# EAGLE design LeguinoUno (EAGLE 9.5.2)
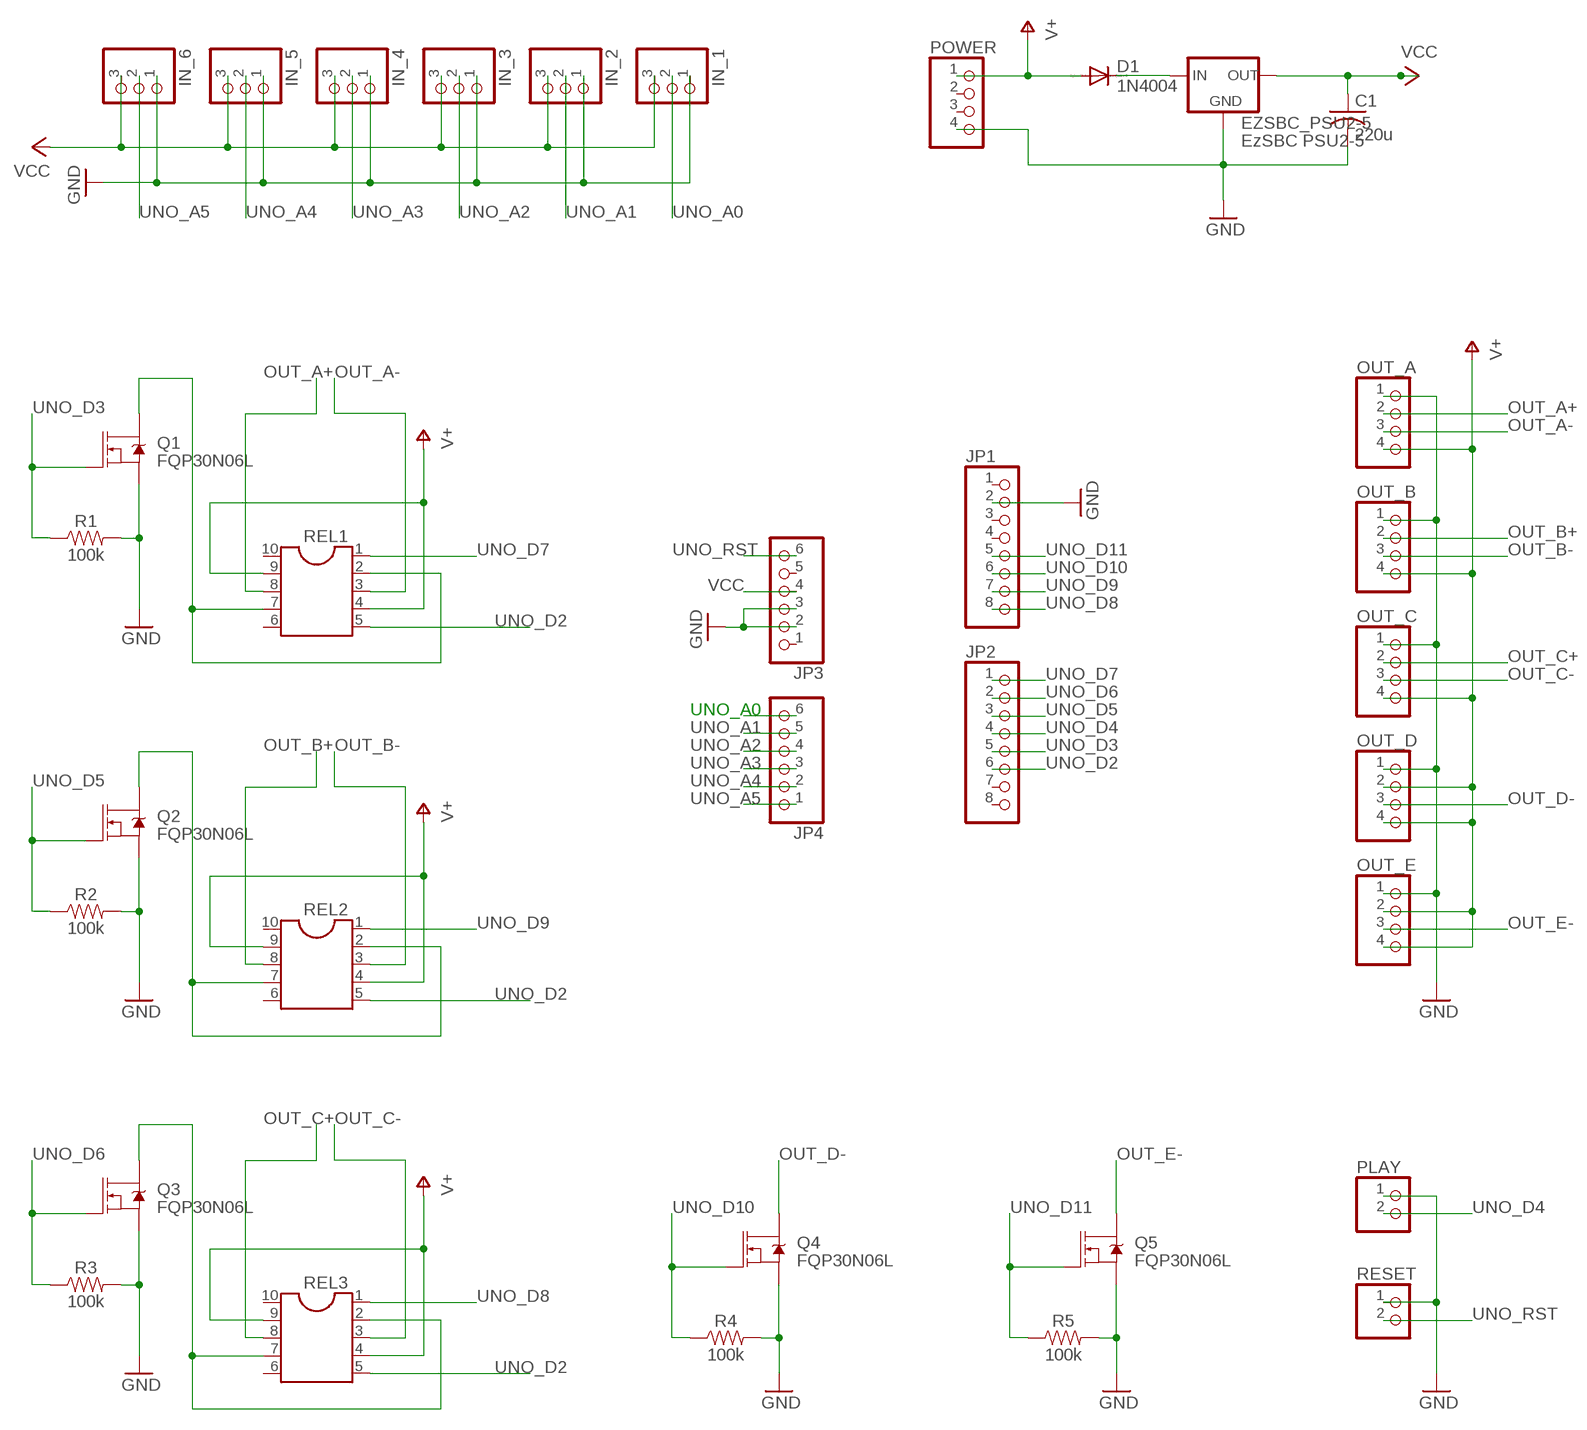
[diagram p0: schematic, sheet 1]

## Parts
C1  220u  C-US050-030X075  [C050-030X075]
D1  1N4004  [DO41-10]
EZSBC_PSU2-5  EzSBC PSU2-5  V_REG_78XX-TO-220  [TO-220-ALT]
IN_1  PINHD-1X3  [1X03]
IN_2  PINHD-1X3  [1X03]
IN_3  PINHD-1X3  [1X03]
IN_4  PINHD-1X3  [1X03]
IN_5  PINHD-1X3  [1X03]
IN_6  PINHD-1X3  [1X03]
JP1  PINHD-1X8  [1X08]
JP2  PINHD-1X8  [1X08]
JP3  PINHD-1X6  [1X06]
JP4  PINHD-1X6  [1X06]
OUT_A  PINHD-1X4  [1X04]
OUT_B  PINHD-1X4  [1X04]
OUT_C  PINHD-1X4  [1X04]
OUT_D  PINHD-1X4  [1X04]
OUT_E  PINHD-1X4  [1X04]
PLAY  PINHD-1X2  [1X02]
POWER  PINHD-1X4  [1X04]
Q1  FQP30N06L  MOSFET-NCH-FQP30N06L  [TO220V]
Q2  FQP30N06L  MOSFET-NCH-FQP30N06L  [TO220V]
Q3  FQP30N06L  MOSFET-NCH-FQP30N06L  [TO220V]
Q4  FQP30N06L  MOSFET-NCH-FQP30N06L  [TO220V]
Q5  FQP30N06L  MOSFET-NCH-FQP30N06L  [TO220V]
R1  100k  100KOHM-HORIZ-1/4W-1%  [AXIAL-0.3]
R2  100k  100KOHM-HORIZ-1/4W-1%  [AXIAL-0.3]
R3  100k  100KOHM-HORIZ-1/4W-1%  [AXIAL-0.3]
R4  100k  100KOHM-HORIZ-1/4W-1%  [AXIAL-0.3]
R5  100k  100KOHM-HORIZ-1/4W-1%  [AXIAL-0.3]
REL1  DIL10  [DIL10]
REL2  DIL10  [DIL10]
REL3  DIL10  [DIL10]
RESET  PINHD-1X2  [1X02]

## Nets
GND [supply]: C1.2 EZSBC_PSU2-5.GND IN_1.1 IN_2.1 IN_3.1 IN_4.1 IN_5.1 IN_6.1 JP1.2 JP3.2 JP3.3 OUT_A.1 OUT_B.1 OUT_C.1 OUT_D.1 OUT_E.1 PLAY.1 POWER.4 Q1.3(S) Q2.3(S) Q3.3(S) Q4.3(S) Q5.3(S) R1.P$2 R2.P$2 R3.P$2 R4.P$2 R5.P$2 RESET.1
N$1 [supply]: D1.C EZSBC_PSU2-5.IN
N$4 [supply]: Q1.2(D) REL1.2 REL1.7
N$13 [supply]: Q2.2(D) REL2.2 REL2.7
N$19 [supply]: Q3.2(D) REL3.2 REL3.7
OUT_A+ [supply]: OUT_A.2 REL1.8
OUT_A- [supply]: OUT_A.3 REL1.3
OUT_B+ [supply]: OUT_B.2 REL2.8
OUT_B- [supply]: OUT_B.3 REL2.3
OUT_C+ [supply]: OUT_C.2 REL3.8
OUT_C- [supply]: OUT_C.3 REL3.3
OUT_D- [supply]: OUT_D.3 Q4.2(D)
OUT_E- [supply]: OUT_E.3 Q5.2(D)
UNO_A0: IN_1.2 JP4.6
UNO_A1: IN_2.2 JP4.5
UNO_A2: IN_3.2 JP4.4
UNO_A3: IN_4.2 JP4.3
UNO_A4: IN_5.2 JP4.2
UNO_A5: IN_6.2 JP4.1
UNO_D2: JP2.6 REL1.5 REL2.5 REL3.5
UNO_D3: JP2.5 Q1.1(G) R1.P$1
UNO_D4: JP2.4 PLAY.2
UNO_D5: JP2.3 Q2.1(G) R2.P$1
UNO_D6: JP2.2 Q3.1(G) R3.P$1
UNO_D7: JP2.1 REL1.1
UNO_D8: JP1.8 REL3.1
UNO_D9: JP1.7 REL2.1
UNO_D10: JP1.6 Q4.1(G) R4.P$1
UNO_D11: JP1.5 Q5.1(G) R5.P$1
UNO_RST: JP3.6 RESET.2
V+ [supply]: D1.A OUT_A.4 OUT_B.4 OUT_C.4 OUT_D.2 OUT_D.4 OUT_E.2 OUT_E.4 POWER.1 REL1.4 REL1.9 REL2.4 REL2.9 REL3.4 REL3.9
VCC [supply]: C1.1 EZSBC_PSU2-5.OUT IN_1.3 IN_2.3 IN_3.3 IN_4.3 IN_5.3 IN_6.3 JP3.4
Unconnected: JP1.1 JP1.3 JP1.4 JP2.7 JP2.8 JP3.1 JP3.5 POWER.2 POWER.3 REL1.6 REL1.10 REL2.6 REL2.10 REL3.6 REL3.10

## Library data of the parts
C1 = adafruit:C-US: CAPACITOR, American symbol
D1 = diode:1N4004: DIODE general purpose rectifier, 1 A
EZSBC_PSU2-5 = SparkFun-IC-Power:V_REG_78XX: Voltage Regulator Standard 78xx regulator. IGO (Input Ground Output). Spark Fun Electronics SKU : COM-00107; PROD_ID: VREG-08450; SF_ID: COM-00107
IN_1-IN_6 = pinhead:PINHD-1X3: PIN HEADER
JP1 JP2 = pinhead:PINHD-1X8: PIN HEADER
JP3 JP4 = pinhead:PINHD-1X6: PIN HEADER
OUT_A OUT_B OUT_C OUT_D OUT_E POWER = pinhead:PINHD-1X4: PIN HEADER
PLAY RESET = pinhead:PINHD-1X2: PIN HEADER
Q1-Q5 = SparkFun-DiscreteSemi:MOSFET-NCH: N-channel MOSFETs Voltage controlled devices that allow control of high current outputs. SparkFun Products: SparkFun OpenScale <https://www.sparkfun.com/products/13261> SparkFun Digital Sandbox <https://www.sparkfun.com/products/12651> SparkFun Monster Moto Shield <https://www.sparkfun.com/products/10182> SparkFun MOSFET Power Controller <https://www.sparkfun.com/products/11214>; PROD_ID: TRANS-10060; VALUE: 60V/32A/35m?
R1-R5 = SparkFun-Resistors:100KOHM: 100k? resistor A resistor is a passive two-terminal electrical component that implements electrical resistance as a circuit element. Resistors act to reduce current flow, and, at the same time, act to lower voltage levels within circuits. - Wikipedia; PROD_ID: RES-12184
REL1-REL3 = ic-package:DIL10: Dual In Line / Socket

## Net classes
0 default: width 0.254 mm, drill 0.254 mm, clearance 0.254 mm
1 supply: width 1.016 mm, drill 1.016 mm, clearance 0.254 mm

## Board
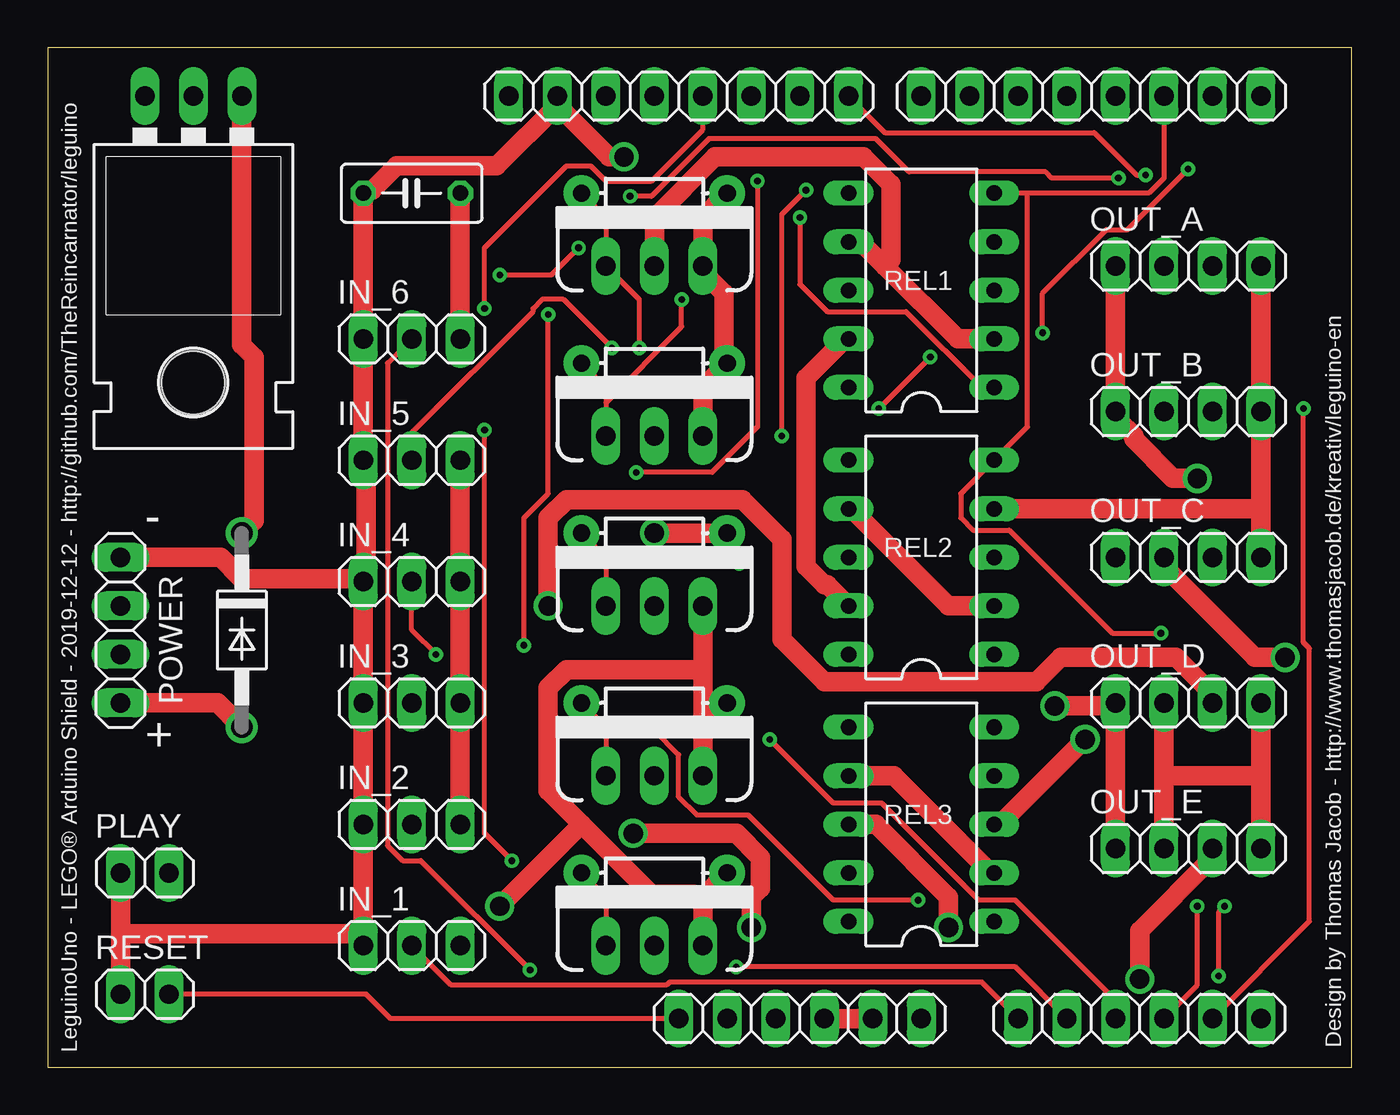
[diagram p1: board, top side]
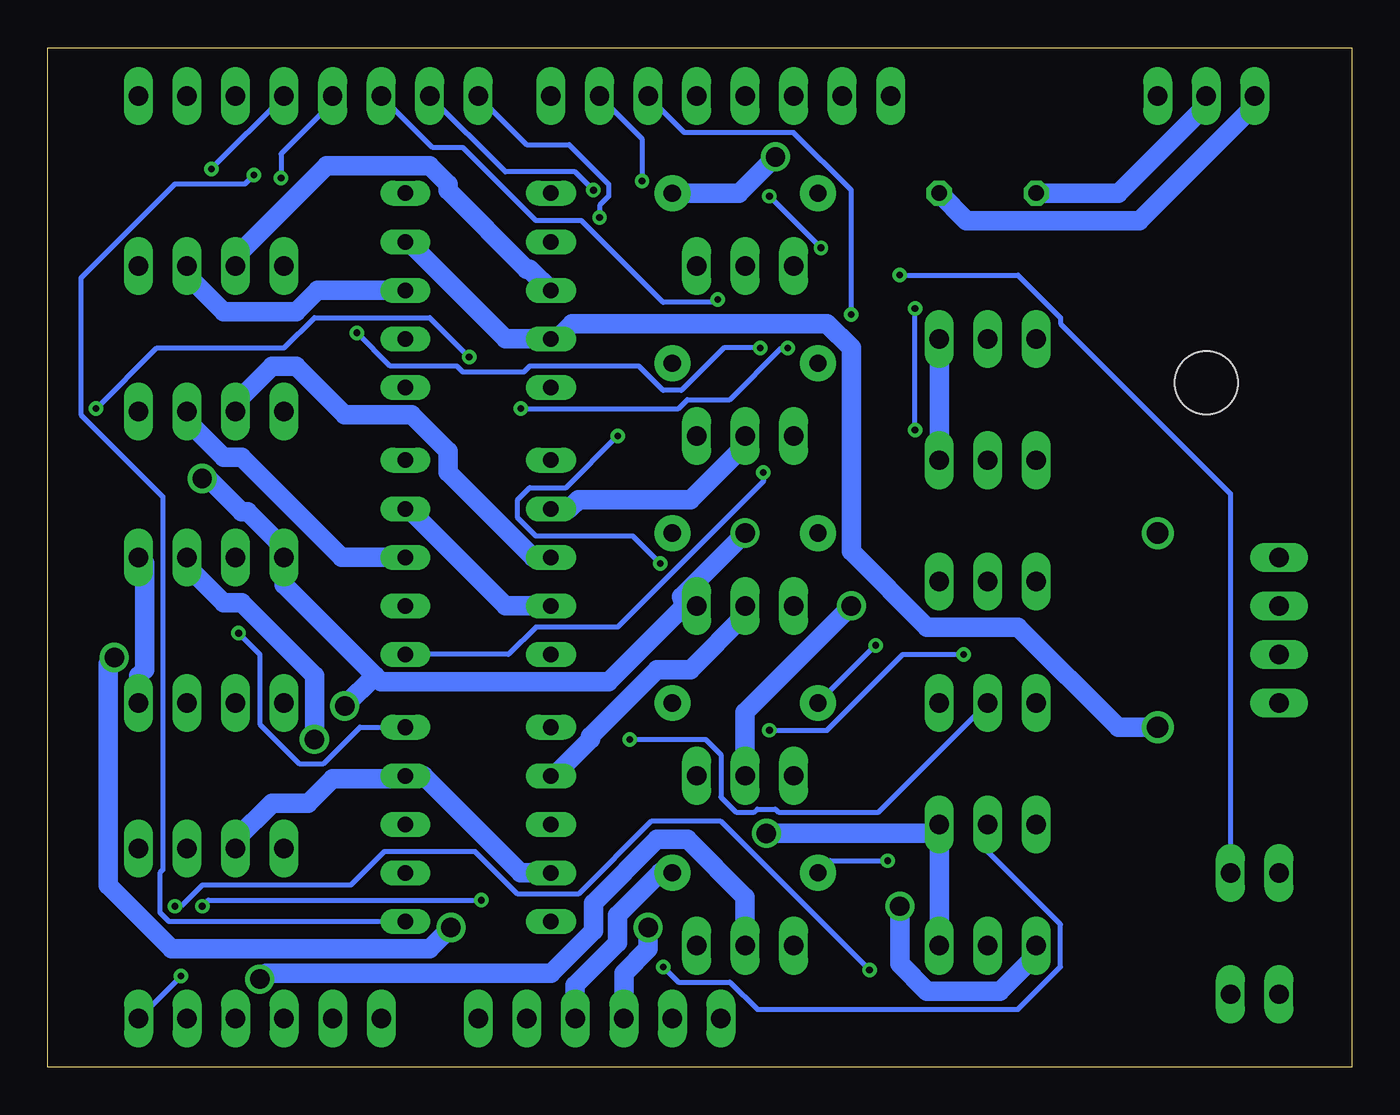
[diagram p2: board, bottom side, seen from below]

Size 68.25 x 53.33 mm. Coordinates in mm from the lower left corner, seen from the top.
Outline: 0,0 68.25,0 68.25,53.33 0,53.33 0,0
Copper layers (1*16): Top 0.035mm / dielectric 1.5mm / Bottom 0.035mm
Design rules "default *": minimum track width 10mil, minimum drill 0.35mm, track to track 10mil, track to pad 10mil, pad to pad 10mil, via to via 10mil, smd to smd 6mil, copper to edge 40mil, drill to drill 40mil, minimum pad ring 10mil, minimum via ring 8mil, stop-mask expansion 4mil, vias tented up to drill 0mil, thermal gap 10mil

### Footprints (pad centres in the part's own frame; a part is rotated, then mirrored left to right if it is on the bottom)
C050-030X075 = drill 0.813 octagon: 1 -2.54,0; 2 2.54,0
DO41-10 = drill 1.118: A 5.08,0; C -5.08,0
TO-220-ALT = drill 1.016 long: GND 0,-3.81; IN -2.54,-3.81; OUT 2.54,-3.81 | hole 3.302: 0,11.176
1X03 = drill 1.016 long: 1 -2.54,0; 2 0,0; 3 2.54,0
1X08 = drill 1.016 long: 1 -8.89,0; 2 -6.35,0; 3 -3.81,0; 4 -1.27,0; 5 1.27,0; 6 3.81,0; 7 6.35,0; 8 8.89,0
1X06 = drill 1.016 long: 1 -6.35,0; 2 -3.81,0; 3 -1.27,0; 4 1.27,0; 5 3.81,0; 6 6.35,0
1X04 = drill 1.016 long: 1 -3.81,0; 2 -1.27,0; 3 1.27,0; 4 3.81,0
1X02 = drill 1.016 long: 1 -1.27,0; 2 1.27,0
TO220V = drill 1.016 long: 1 -2.54,0; 2 0,0; 3 2.54,0
AXIAL-0.3 = drill 0.9 pad 1.88: P$1 -3.81,0; P$2 3.81,0
DIL10 = drill 0.813 long: 1 -5.08,-3.81; 2 -2.54,-3.81; 3 0,-3.81; 4 2.54,-3.81; 5 5.08,-3.81; 6 5.08,3.81; 7 2.54,3.81; 8 0,3.81; 9 -2.54,3.81; 10 -5.08,3.81

### Placement (x,y rotation side)
C1  19.05,45.72 180 top
D1  10.16,22.86 270 top
EZSBC_PSU2-5  7.62,46.99 180 top
IN_1  19.05,6.35 0 top
IN_2  19.05,12.7 0 top
IN_3  19.05,19.05 0 top
IN_4  19.05,25.4 0 top
IN_5  19.05,31.75 0 top
IN_6  19.05,38.1 0 top
JP1  33.02,50.8 0 top
JP2  54.61,50.8 0 top
JP3  39.37,2.54 180 top
JP4  57.15,2.54 180 top
OUT_A  59.69,41.91 0 top
OUT_B  59.69,34.29 0 top
OUT_C  59.69,26.67 0 top
OUT_D  59.69,19.05 0 top
OUT_E  59.69,11.43 0 top
PLAY  5.08,10.16 0 top
POWER  3.81,22.86 90 top
Q1  31.75,41.91 0 top
Q2  31.75,33.02 0 top
Q3  31.75,24.13 0 top
Q4  31.75,15.24 0 top
Q5  31.75,6.35 0 top
R1  31.75,45.72 0 top
R2  31.75,36.83 0 top
R3  31.75,27.94 0 top
R4  31.75,19.05 0 top
R5  31.75,10.16 0 top
REL1  45.72,40.64 90 top
REL2  45.72,26.67 90 top
REL3  45.72,12.7 90 top
RESET  5.08,3.81 0 top

### Tracks (layer width: path | path; a pad name or v marks a point on that pad's centre or on a via)
GND  (via drill 1.02)
  Top 1.016: JP3.2 JP3.3 | 34.29,8.89 Q5.3 | R5.P$2 34.29,8.89 | OUT_A.1 OUT_B.1 56.04,33.81 56.83,33.02 56.83,32.86 58.9,30.8 v60.17,30.8 | OUT_E.1 OUT_D.1 55.4,18.89 v52.7,18.89 | Q4.3 34.29,17.78 34.61,18.1 | R4.P$2 34.61,18.1 | 34.29,20.8 34.29,18.41 34.61,18.1 | 34.29,20.8 Q3.3 | v31.75,27.94 R3.P$2 | 27.94,12.7 26.19,14.45 26.19,19.84 27.15,20.8 34.29,20.8 | 27.94,12.7 31.59,9.05 33.81,9.05 34.29,8.89 | PLAY.1 3.81,6.99 | 3.81,6.99 RESET.1 | 16.51,6.99 IN_2.1 IN_3.1 IN_4.1 | 16.51,6.99 IN_1.1 | POWER.4 9.05,26.67 10.16,25.56 16.03,25.56 IN_4.1 | 16.51,6.99 3.81,6.99 | Q2.3 34.29,35.56 R2.P$2 35.4,37.31 35.4,40.48 34.45,41.43 Q1.3 34.29,44.45 R1.P$2 | v30.16,47.62 29.37,47.62 26.99,50.01 JP1.2 26.67,50.32 23.5,47.15 18.26,47.15 16.99,45.88 C1.2 IN_6.1 IN_5.1 16.67,31.27 16.67,25.88 IN_4.1 | v23.65,8.41 27.94,12.7
  Bottom 1.016: JP3.3 40.64,4.29 38.42,6.51 38.42,7.94 36.19,10.16 R5.P$2 | 51.12,20.48 50.8,20.16 38.89,20.16 34.92,24.13 | 51.12,20.48 55.88,25.24 OUT_C.1 55.88,27.15 57.78,29.05 58.1,29.05 59.85,30.8 v60.17,30.8 | Q3.3 34.92,24.13 | v31.75,27.94 35.08,24.61 34.92,24.13 | 51.12,20.48 v52.7,18.89 | EZSBC_PSU2-5.GND 7.62,50.32 12.22,45.72 C1.2 | R1.P$2 32.07,45.72 v30.16,47.62 | v23.65,8.41 23.65,5.4 22.23,3.97 18.41,3.97 16.51,5.87 IN_1.1
N$1
  Top 1.016: EZSBC_PSU2-5.IN 10.16,37.78 10.8,37.15 10.8,28.57 D1.C
N$4
  Top 1.016: REL1.2 47.62,38.1 43.81,41.91 | 43.81,41.91 42.55,43.18 REL1.7 | Q1.2 31.75,44.45 34.92,47.62 42.7,47.62 44.13,46.2 44.13,42.23 43.81,41.91
N$13
  Top 1.016: REL2.2 47.15,24.13 42.07,29.21 REL2.7
  Bottom 1.016: Q2.2 31.75,32.54 34.61,29.69 40.48,29.69 40.96,29.21 REL2.7
N$19
  Top 1.016: REL3.7 44.29,15.24 49.37,10.16 REL3.2
  Bottom 1.016: Q3.2 31.75,23.65 34.61,20.8 36.35,20.8 39.85,17.3 39.85,17.14 41.75,15.24 REL3.7
OUT_A+
  Bottom 1.016: REL1.8 43.02,41.75 43.18,41.75 47.31,45.88 47.31,46.2 48.26,47.15 53.66,47.15 58.42,42.39 OUT_A.2
OUT_A-
  Bottom 1.016: REL1.3 54.13,40.64 55.25,39.53 59.05,39.53 60.96,41.43 OUT_A.3
OUT_B+
  Bottom 1.016: REL2.8 42.86,26.67 47.31,31.11 47.31,32.23 49.21,34.13 52.7,34.13 55.25,36.67 56.52,36.67 58.42,34.77 OUT_B.2
OUT_B-
  Bottom 1.016: REL2.3 52.86,26.67 58.1,31.91 59.05,31.91 60.96,33.81 OUT_B.3
OUT_C+  (via drill 1.02)
  Top 1.016: REL3.8 43.34,12.7 47.15,8.89 v47.15,7.3 | v64.77,21.43 63.18,21.43 58.42,26.19 OUT_C.2
  Bottom 1.016: v47.15,7.3 48.26,6.19 61.75,6.19 65.09,9.52 65.09,21.11 v64.77,21.43
OUT_C-  (via drill 1.02)
  Top 1.016: REL3.3 49.85,12.7 v54.29,17.14
  Bottom 1.016: v54.29,17.14 54.29,20.48 58.1,24.29 59.05,24.29 60.96,26.19 OUT_C.3
OUT_D-  (via drill 1.02)
  Top 1.016: v26.19,24.13 26.19,28.73 27.15,29.69 36.35,29.69 38.42,27.62 38.42,22.38 40.64,20.16 51.75,20.16 53.02,21.43 59.05,21.43 60.96,19.53 OUT_D.3
  Bottom 1.016: Q4.2 31.75,18.57 v26.19,24.13
OUT_E-  (via drill 1.02)
  Top 1.016: v57.15,4.6 57.15,7.14 60.96,10.95 OUT_E.3
  Bottom 1.016: Q5.2 31.75,8.89 34.77,11.91 36.35,11.91 39.69,8.57 39.69,7.14 41.91,4.92 56.83,4.92 v57.15,4.6
UNO_A0
  Top 0.254: IN_1.2 21.11,4.29 32.39,4.29 32.54,4.44 48.89,4.44 JP4.6
UNO_A1  (via drill 0.35)
  Top 0.254: v36.04,5.24 50.64,5.24 JP4.5
  Bottom 0.254: IN_2.2 19.05,11.27 15.24,7.46 15.24,5.24 17.46,3.02 31.11,3.02 32.54,4.44 35.24,4.44 v36.04,5.24
UNO_A2  (via drill 0.35)
  Top 0.254: v37.78,17.14 41.12,13.81 43.66,13.81 48.74,8.73 50.64,8.73 55.88,3.49 JP4.4
  Bottom 0.254: IN_3.2 24.77,13.33 30,13.33 30.16,13.49 31.11,13.49 31.27,13.33 32.23,13.33 33.02,14.13 33.02,16.35 33.81,17.14 v37.78,17.14
UNO_A3  (via drill 0.35)
  Top 0.254: IN_4.2 19.05,22.86 v20.32,21.59 | v30.48,17.62 31.75,17.62 33.02,16.35 33.02,14.13 33.97,13.18 36.67,13.18 41.12,8.73 v45.56,8.73 | v60.17,8.41 60.17,4.29 JP4.3
  Bottom 0.254: v20.32,21.59 23.5,21.59 27.46,17.62 v30.48,17.62 | v45.56,8.73 59.85,8.73 v60.17,8.41
UNO_A4  (via drill 0.35)
  Top 0.254: IN_5.2 19.05,33.18 25.4,39.53 25.4,39.69 25.88,40.16 26.99,40.16 v29.53,37.62 | v46.2,37.15 v43.5,34.45 | v65.72,34.45 65.72,22.22 66.04,21.91 66.04,7.62 JP4.2
  Bottom 0.254: v29.53,37.62 29.84,37.62 32.54,34.93 34.77,34.93 35.24,34.45 v43.5,34.45 | v46.2,37.15 48.26,39.21 54.29,39.21 55.88,37.62 62.55,37.62 v65.72,34.45
UNO_A5  (via drill 0.35)
  Top 0.254: v61.28,4.76 61.28,8.1 v61.59,8.41 | v25.24,5.08 19.53,10.79 18.57,10.79 17.78,11.59 17.78,36.83 IN_6.2
  Bottom 0.254: v61.28,4.76 JP4.1 | v61.59,8.41 61.28,8.41 60.17,9.52 52.39,9.52 50.64,11.27 45.88,11.27 43.66,9.05 40.48,9.05 36.67,12.86 33.02,12.86 v25.24,5.08
UNO_D2  (via drill 0.35)
  Top 0.254: 51.28,45.72 57.63,45.72 58.42,46.51 JP2.6 | 51.28,45.72 REL1.5 | v58.26,22.7 55.72,22.7 50.32,28.1 48.42,28.1 47.78,28.73 47.78,30 REL2.5 51.28,33.5 51.28,45.72
  Bottom 0.254: REL3.5 51.91,17.78 53.82,15.88 55.09,15.88 57.15,17.94 57.15,21.59 v58.26,22.7
UNO_D3  (via drill 0.35)
  Top 0.254: R1.P$1 29.21,44.45 Q1.1 30.96,40.16 v30.96,37.62 | v59.69,46.99 56.52,43.82 55.4,43.82 52.07,40.48 v52.07,38.42
  Bottom 0.254: v59.69,46.99 JP2.5 | v52.07,38.42 50.32,36.67 46.83,36.67 46.51,36.35 43.34,36.35 43.02,36.67 37.31,36.67 36.04,35.4 35.08,35.4 32.86,37.62 v30.96,37.62
UNO_D4  (via drill 0.35)
  Top 0.254: v23.65,41.43 26.35,41.43 v27.78,42.86 | v30.48,45.56 31.59,45.56 34.61,48.58 43.34,48.58 45.08,46.83 52.23,46.83 52.55,46.51 v56.04,46.51
  Bottom 0.254: PLAY.2 6.35,30 15.24,38.89 15.24,39.21 17.46,41.43 v23.65,41.43 | v30.48,45.56 v27.78,42.86 | v56.04,46.51 56.04,47.78 53.34,50.48 JP2.4
UNO_D5  (via drill 0.35)
  Top 0.254: 29.21,34.77 29.21,35.56 R2.P$1 | 29.21,34.77 Q2.1 | v33.18,40.16 33.18,38.73 29.21,34.77
  Bottom 0.254: JP2.3 48.1,48.1 46.51,48.1 42.7,44.29 40.32,44.29 36.04,40.01 33.34,40.01 v33.18,40.16
UNO_D6  (via drill 0.35)
  Top 0.254: 29.21,26.19 29.21,26.67 R3.P$1 | 29.21,26.19 Q3.1 | v39.69,45.88 38.42,44.61 v38.42,33.02 | v36.19,26.35 32.86,26.35 32.7,26.19 29.21,26.19
  Bottom 0.254: JP2.2 44.29,46.83 40.64,46.83 v39.69,45.88 | v38.42,33.02 41.12,30.32 43.02,30.32 43.66,29.69 43.66,28.73 42.7,27.78 37.62,27.78 v36.19,26.35
UNO_D7  (via drill 0.35)
  Top 0.254: REL1.1 48.89,35.56 44.93,39.53 40.8,39.53 39.37,40.96 v39.37,44.45
  Bottom 0.254: v39.37,44.45 39.37,45.09 38.89,45.56 38.89,46.2 40.96,48.26 43.18,48.26 JP2.1
UNO_D8  (via drill 0.35)
  Top 0.254: v57.47,46.67 56.99,46.67 54.77,48.9 43.81,48.9 JP1.8
  Bottom 0.254: REL3.1 61.91,7.62 62.39,8.1 62.39,10.16 62.23,10.32 62.23,29.85 66.52,34.13 66.52,41.28 61.59,46.2 57.94,46.2 v57.47,46.67
UNO_D9  (via drill 0.35)
  Top 0.254: v30.8,31.11 34.77,31.11 37.15,33.5 v37.15,46.36
  Bottom 0.254: REL2.1 44.13,21.59 42.7,23.02 38.42,23.02 30.8,30.64 v30.8,31.11 | v37.15,46.36 37.15,48.58 JP1.7
UNO_D10  (via drill 0.35)
  Top 0.254: Q4.1 29.21,17.78 R4.P$1 | v26.19,39.37 26.19,30 24.92,28.73 v24.92,22.07
  Bottom 0.254: JP1.6 34.92,48.9 29.21,48.9 26.19,45.88 v26.19,39.37 | R4.P$1 v24.92,22.07
UNO_D11  (via drill 0.35)
  Top 0.254: Q5.1 29.21,8.89 R5.P$1 | JP1.5 34.29,49.05 31.59,46.36 29.21,46.36 28.42,47.15 27.15,47.15 22.86,42.86 v22.86,39.69 | v22.86,33.34 22.86,12.22 v24.29,10.79
  Bottom 0.254: v22.86,33.34 v22.86,39.69 | v24.29,10.79 27.3,10.79 R5.P$1
UNO_RST
  Top 0.254: RESET.2 16.67,3.81 17.94,2.54 JP3.6
V+
  Top 1.016: OUT_D.2 58.42,15.24 | 58.42,15.24 OUT_E.2 | OUT_D.4 63.5,15.24 | 63.5,15.24 OUT_E.4 | 63.5,15.24 58.42,15.24 | 63.5,29.21 OUT_B.4 OUT_A.4 | 63.5,29.21 OUT_C.4 | 63.5,29.21 REL2.4 | POWER.1 8.89,19.05 D1.A | REL2.9 40.8,25.24 40.64,25.24 39.69,26.19 39.69,36.04 41.75,38.1 REL1.9
  Bottom 1.016: REL3.9 43.5,10.16 48.58,15.24 REL3.4 50.01,15.08 53.34,15.08 54.61,13.81 56.52,13.81 58.42,11.91 OUT_E.2 | REL2.9 44.29,24.13 49.37,29.21 REL2.4 | OUT_D.4 63.5,20.48 63.18,20.8 63.18,26.35 OUT_C.4 | REL1.4 49.37,43.18 44.29,38.1 REL1.9 41.43,38.26 40.8,38.89 27.46,38.89 26.19,37.62 26.19,26.99 22.23,23.02 17.46,23.02 12.22,17.78 D1.A
VCC  (via drill 1.02)
  Top 1.016: IN_6.3 C1.1 | IN_5.3 IN_4.3 IN_3.3 IN_2.3 | v36.83,7.3 36.83,8.89 37.31,9.37 37.31,10.95 36.04,12.22 v30.64,12.22
  Bottom 1.016: EZSBC_PSU2-5.OUT 5.08,50.32 11.11,44.29 20.16,44.29 C1.1 | IN_1.3 IN_2.3 22.07,12.22 v30.64,12.22 | JP3.4 38.1,4.92 36.83,6.19 v36.83,7.3 | IN_5.3 IN_6.3

### Text on the board
tNames: - | + | Design by Thomas Jacob - http://www.thomasjacob.de/kreativ/leguino-en | LeguinoUno - LEGO® Arduino Shield - 2019-12-12 - http://github.com/TheReincarnator/leguino